# Altium schematic sheet DAC.SchDoc
size A4
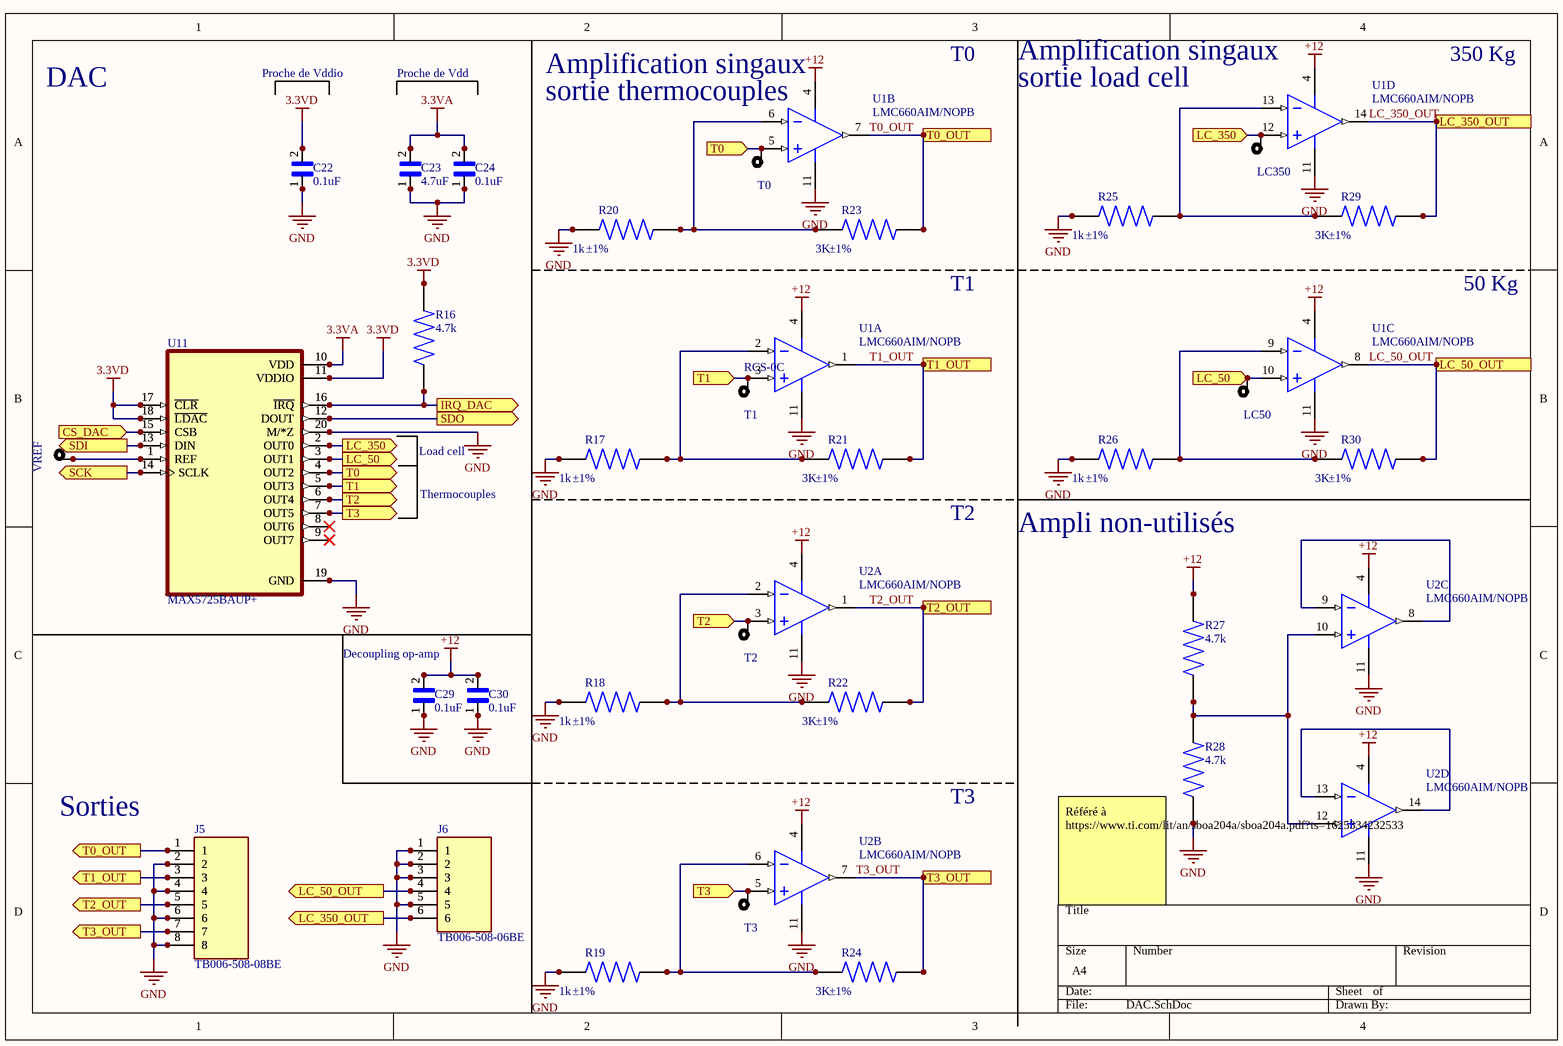
[diagram p0: DAC.SchDoc]

## Parts
C22  value 0.1uF  [C3216C0G1H104J160AA]  (hidden comment: C3216C0G1H104J160AA)
C23  value 4.7uF  [EMK212BB7475MD-T]  (hidden comment: EMK212BB7475MD-T)
C24  value 0.1uF  [C3216C0G1H104J160AA]  (hidden comment: C3216C0G1H104J160AA)
C29  value 0.1uF  [C3216C0G1H104J160AA]  (hidden comment: C3216C0G1H104J160AA)
C30  value 0.1uF  [C3216C0G1H104J160AA]  (hidden comment: C3216C0G1H104J160AA)
J5  TB006-508-08BE  [TB006-508-08BE]
J6  TB006-508-06BE  [TB006-508-06BE]
LC50  RCS-0C  [RCS-0C]  (value not drawn)
LC350  RCS-0C  [RCS-0C]  (value not drawn)
R16  value 4.7k  [CRGH0805F4K7]  (hidden comment: CRGH0805F4K7)
R17  value 1k  Tolerance: ±1%  [CR0805-FX-1001ELF]  (hidden comment: CR0805-FX-1001ELF)
R18  value 1k  Tolerance: ±1%  [CR0805-FX-1001ELF]  (hidden comment: CR0805-FX-1001ELF)
R19  value 1k  Tolerance: ±1%  [CR0805-FX-1001ELF]  (hidden comment: CR0805-FX-1001ELF)
R20  value 1k  Tolerance: ±1%  [CR0805-FX-1001ELF]  (hidden comment: CR0805-FX-1001ELF)
R21  value 3K  Tolerance: ±1%  [CRG0805F3K0]  (hidden comment: CRG0805F3K0)
R22  value 3K  Tolerance: ±1%  [CRG0805F3K0]  (hidden comment: CRG0805F3K0)
R23  value 3K  Tolerance: ±1%  [CRG0805F3K0]  (hidden comment: CRG0805F3K0)
R24  value 3K  Tolerance: ±1%  [CRG0805F3K0]  (hidden comment: CRG0805F3K0)
R25  value 1k  Tolerance: ±1%  [CR0805-FX-1001ELF]  (hidden comment: CR0805-FX-1001ELF)
R26  value 1k  Tolerance: ±1%  [CR0805-FX-1001ELF]  (hidden comment: CR0805-FX-1001ELF)
R27  value 4.7k  [CRGH0805F4K7]  (hidden comment: CRGH0805F4K7)
R28  value 4.7k  [CRGH0805F4K7]  (hidden comment: CRGH0805F4K7)
R29  value 3K  Tolerance: ±1%  [CRG0805F3K0]  (hidden comment: CRG0805F3K0)
R30  value 3K  Tolerance: ±1%  [CRG0805F3K0]  (hidden comment: CRG0805F3K0)
T0  RCS-0C  [RCS-0C]  (value not drawn)
T1  RCS-0C  [RCS-0C]
T2  RCS-0C  [RCS-0C]  (value not drawn)
T3  RCS-0C  [RCS-0C]  (value not drawn)
U1  LMC660AIM/NOPB  [D0014A_N]  (parts A,B,C,D of 4)
U2  LMC660AIM/NOPB  [D0014A_N]  (parts A,B,C,D of 4)
U11  MAX5725BAUP+  [MAX5725BAUP+]
VREF  RCS-0C  [RCS-0C]  (value not drawn)

## Ports
CS_DAC (in), IRQ_DAC (out), LC_50 (in), LC_50 (out), LC_50_OUT (in), LC_50_OUT (out), LC_350 (in), LC_350 (out), LC_350_OUT (in), LC_350_OUT (out), SCK (out), SDI (out), SDO (out), T0 (in), T0 (out), T0_OUT (in), T0_OUT (out), T1 (in), T1 (out), T1_OUT (in), T1_OUT (out), T2 (in), T2 (out), T2_OUT (in), T2_OUT (out), T3 (in), T3 (out), T3_OUT (in), T3_OUT (out)

## Nets
3.3VA: C23.2 C24.2 U11.10(VDD)
3.3VD: C22.2 R16.2 U11.11(VDDIO) U11.17(~{CLR}) U11.18(~{LDAC})
+12: C29.2 C30.2 R27.2 U1.4(V+) U2.4(V+)
GND: C22.1 C23.1 C24.1 C29.1 C30.1 J5.2 J5.4 J5.6 J5.8 J6.1 J6.2 J6.3 J6.5 R17.1 R18.1 R19.1 R20.1 R25.1 R26.1 R28.1 U1.11(V-) U2.11(V-) U11.19(GND) U11.20(M/*Z)
CS_DAC: U11.15(CSB) ; port CS_DAC
IRQ_DAC: R16.1 U11.16(~{IRQ}) ; port IRQ_DAC
LC_50: LC50.1 U1.10(IN3+) U11.3(OUT1) ; port LC_50
LC_50_OUT: J6.4 R30.2 U1.8(OUT3) ; port LC_50_OUT
LC_350: LC350.1 U1.12(IN4+) U11.2(OUT0) ; port LC_350
LC_350_OUT: J6.6 R29.2 U1.14(OUT4) ; port LC_350_OUT
SCK: U11.14(SCLK) ; port SCK
SDI: U11.13(DIN) ; port SDI
SDO: U11.12(DOUT) ; port SDO
T0: T0.1 U1.5(IN2+) U11.4(OUT2) ; port T0
T0_OUT: J5.1 R23.2 U1.7(OUT2) ; port T0_OUT
T1: T1.1 U1.3(IN1+) U11.5(OUT3) ; port T1
T1_OUT: J5.3 R21.2 U1.1(OUT1) ; port T1_OUT
T2: T2.1 U2.3(IN1+) U11.6(OUT4) ; port T2
T2_OUT: J5.5 R22.2 U2.1(OUT1) ; port T2_OUT
T3: T3.1 U2.5(IN2+) U11.7(OUT5) ; port T3
T3_OUT: J5.7 R24.2 U2.7(OUT2) ; port T3_OUT
NetR17_2: R17.2 R21.1 U1.2(IN1-)
NetR18_2: R18.2 R22.1 U2.2(IN1-)
NetR19_2: R19.2 R24.1 U2.6(IN2-)
NetR20_2: R20.2 R23.1 U1.6(IN2-)
NetR25_2: R25.2 R29.1 U1.13(IN4-)
NetR26_2: R26.2 R30.1 U1.9(IN3-)
NetR27_1: R27.1 R28.2 U2.10(IN3+) U2.12(IN4+)
NetU2_8: U2.8(OUT3) U2.9(IN3-)
NetU2_13: U2.13(IN4-) U2.14(OUT4)
NetU11_1: U11.1(REF) VREF.1

Not connected (* = marked no-connect by the designer): U11 8(OUT6)* 9(OUT7)*

## Notes on the sheet
- DAC
- Proche de Vddio
- Proche de Vdd
- (near U1) Amplification singaux
- (near U1) sortie thermocouples
- T0
- sortie load cell
- 350 Kg
- T1
- 50 Kg
- Load cell
- Thermocouples
- T2
- (near R26) Ampli non-utilisés
- Decoupling op-amp
- (near J5) Sorties
- T3
- (near R28) Référé à https://www.ti.com/lit/an/sboa204a/sboa204a.pdf?ts=1625334232533

## Library data of the parts
C23 = EMK212BB7475MD-T: CAP CER 4.7UF 16V X7R 0805
J6 = TB006-508-06BE: TERMINAL BLOCK, SCREW TYPE, 5.08
LC50 LC350 T0-T3 VREF = RCS-0C: PC TEST POINT NATURAL
R16 R27 R28 = CRGH0805F4K7: CRGH0805 1% 4K7 0.33W; Tolerance: ±1%
R17-R20 R25 R26 = CR0805-FX-1001ELF: 1 kOhms ±1% 0.125W, 1/8W Chip Resistor 0805
R21-R24 R29 R30 = CRG0805F3K0: RES SMD 3K OHM 1% 1/8W 0805
U1 U2 = CMP-0055-00881-3: CMOS Quad Operational Amplifier, 14-pin Narrow SOIC, Pb-Free; Manufacturer: Texas Instruments; PackageTopMarking: NSUZXYTTE#*LMC660AIM; PowerWise: N; CompType: Amplifiers; Package Reference: D0014A; PackageDescription: Molded Package S.O., .150in Wide, 14 Lead; RoHS: Y; Code_IPC: SOIC127P600-14; ComponentLink1URL: http://www.ti.com/general/docs/lit/getliterature.tsp?genericPartNumber=LMC660&fileType=pdf; ComponentLink1Description: Datasheet URL; PinCount: 14; Code_JEDEC: MS-012AB
U11 = MAX5725BAUP: IC DAC 12BIT V-OUT 20TSSOP